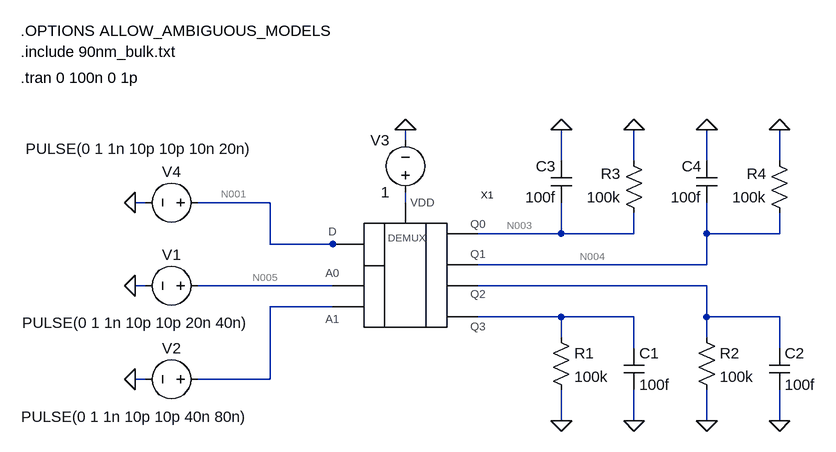
[diagram p0: schematic demux_tests.asc]
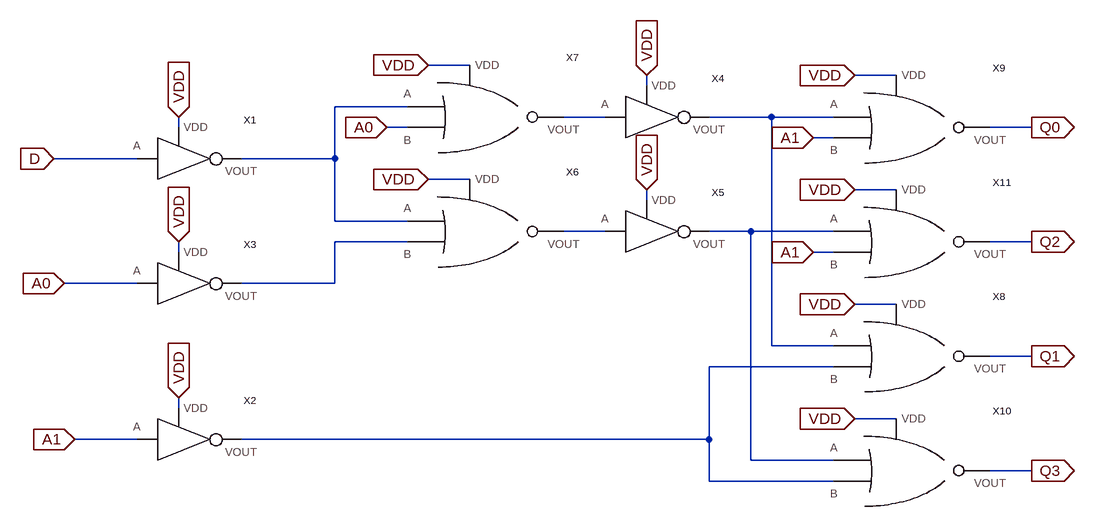
[diagram p1: sub-circuit demux.asc]
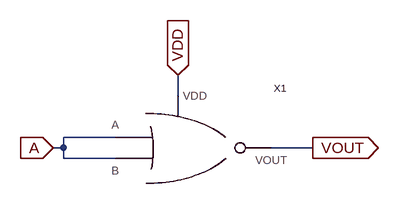
[diagram p2: sub-circuit not.asc]
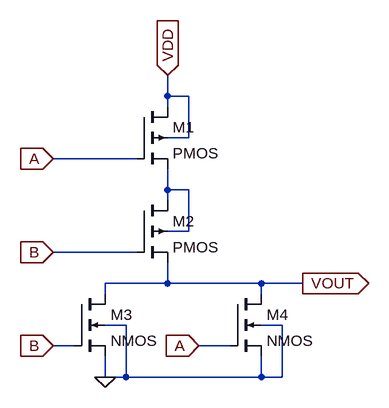
[diagram p3: sub-circuit nor.asc]
demux_tests.asc, the LTspice schematic file:
Version 4.1
SHEET 1 880 680
WIRE 208 64 208 48
WIRE 448 96 448 48
WIRE 560 96 560 48
WIRE 672 96 672 48
WIRE 784 96 784 48
WIRE -192 160 -208 160
WIRE 0 160 -112 160
WIRE 208 160 208 144
WIRE 448 208 448 160
WIRE 448 208 320 208
WIRE 560 208 560 176
WIRE 560 208 448 208
WIRE 672 208 672 160
WIRE 784 208 784 176
WIRE 784 208 672 208
WIRE 0 224 0 160
WIRE 96 224 0 224
WIRE 112 224 96 224
WIRE 672 256 672 208
WIRE 672 256 320 256
WIRE -192 288 -208 288
WIRE 96 288 -112 288
WIRE 672 288 320 288
WIRE 96 320 0 320
WIRE 448 336 320 336
WIRE 560 336 448 336
WIRE 672 336 672 288
WIRE 784 336 672 336
WIRE 448 368 448 336
WIRE 672 368 672 336
WIRE 560 384 560 336
WIRE 784 384 784 336
WIRE -192 432 -208 432
WIRE 0 432 0 320
WIRE 0 432 -112 432
WIRE 448 496 448 448
WIRE 560 496 560 448
WIRE 672 496 672 448
WIRE 784 496 784 448
FLAG 560 496 0
FLAG 448 496 0
FLAG 208 48 0
FLAG -208 288 0
FLAG -208 432 0
FLAG -208 160 0
FLAG 784 496 0
FLAG 672 496 0
FLAG 448 48 0
FLAG 560 48 0
FLAG 672 48 0
FLAG 784 48 0
SYMBOL voltage 208 160 R180
WINDOW 0 24 96 Left 2
WINDOW 3 24 16 Left 2
WINDOW 123 0 0 Left 0
WINDOW 39 0 0 Left 0
SYMATTR InstName V3
SYMATTR Value 1
SYMBOL res 432 352 R0
SYMATTR InstName R1
SYMATTR Value 100k
SYMBOL cap 544 384 R0
SYMATTR InstName C1
SYMATTR Value 100f
SYMBOL voltage -96 288 R90
WINDOW 0 -32 56 VBottom 2
WINDOW 3 41 110 VTop 2
WINDOW 123 0 0 Left 0
WINDOW 39 0 0 Left 0
SYMATTR InstName V1
SYMATTR Value PULSE(0 1 1n 10p 10p 20n 40n)
SYMBOL voltage -96 432 R90
WINDOW 0 -32 56 VBottom 2
WINDOW 3 42 112 VTop 2
WINDOW 123 0 0 Left 0
WINDOW 39 0 0 Left 0
SYMATTR InstName V2
SYMATTR Value PULSE(0 1 1n 10p 10p 40n 80n)
SYMBOL demux 208 272 R0
SYMATTR InstName X1
SYMBOL voltage -96 160 R90
WINDOW 0 -32 56 VBottom 2
WINDOW 3 -98 105 VTop 2
WINDOW 123 0 0 Left 0
WINDOW 39 0 0 Left 0
SYMATTR InstName V4
SYMATTR Value PULSE(0 1 1n 10p 10p 10n 20n)
SYMBOL res 656 352 R0
SYMATTR InstName R2
SYMATTR Value 100k
SYMBOL cap 768 384 R0
SYMATTR InstName C2
SYMATTR Value 100f
SYMBOL res 576 192 R180
WINDOW 0 36 76 Left 2
WINDOW 3 36 40 Left 2
SYMATTR InstName R3
SYMATTR Value 100k
SYMBOL cap 464 160 R180
WINDOW 0 24 56 Left 2
WINDOW 3 24 8 Left 2
SYMATTR InstName C3
SYMATTR Value 100f
SYMBOL res 800 192 R180
WINDOW 0 36 76 Left 2
WINDOW 3 36 40 Left 2
SYMATTR InstName R4
SYMATTR Value 100k
SYMBOL cap 688 160 R180
WINDOW 0 24 56 Left 2
WINDOW 3 24 8 Left 2
SYMATTR InstName C4
SYMATTR Value 100f
TEXT -384 -72 Left 2 !.include 90nm_bulk.txt
TEXT -384 -32 Left 2 !.tran 0 100n 0 1p
TEXT -384 -104 Left 2 !.OPTIONS ALLOW_AMBIGUOUS_MODELS

demux.asc, the sub-circuit schematic file:
Version 4.1
SHEET 1 1972 872
WIRE 656 32 592 32
WIRE 1312 48 1248 48
WIRE 928 64 928 48
WIRE 560 96 448 96
WIRE 864 112 800 112
WIRE 1120 112 1024 112
WIRE 1216 112 1120 112
WIRE 208 128 208 112
WIRE 560 128 528 128
WIRE 1520 128 1456 128
WIRE 1216 144 1184 144
WIRE 144 176 16 176
WIRE 448 176 448 96
WIRE 448 176 304 176
WIRE 656 208 592 208
WIRE 1312 224 1248 224
WIRE 928 240 928 224
WIRE 448 272 448 176
WIRE 560 272 448 272
WIRE 864 288 800 288
WIRE 1088 288 1024 288
WIRE 1216 288 1088 288
WIRE 560 304 448 304
WIRE 1520 304 1456 304
WIRE 208 320 208 304
WIRE 1216 320 1184 320
WIRE 144 368 32 368
WIRE 448 368 448 304
WIRE 448 368 304 368
WIRE 1312 400 1248 400
WIRE 1120 464 1120 112
WIRE 1216 464 1120 464
WIRE 1520 480 1456 480
WIRE 1216 496 1024 496
WIRE 208 560 208 544
WIRE 1312 576 1248 576
WIRE 144 608 48 608
WIRE 1024 608 1024 496
WIRE 1024 608 304 608
WIRE 1088 640 1088 288
WIRE 1216 640 1088 640
WIRE 1520 656 1456 656
WIRE 1024 672 1024 608
WIRE 1216 672 1024 672
FLAG 16 176 D
IOPIN 16 176 In
FLAG 48 608 A1
IOPIN 48 608 In
FLAG 32 368 A0
IOPIN 32 368 In
FLAG 528 128 A0
IOPIN 528 128 In
FLAG 1184 144 A1
IOPIN 1184 144 In
FLAG 1520 128 Q0
IOPIN 1520 128 Out
FLAG 1184 320 A1
IOPIN 1184 320 In
FLAG 1520 304 Q2
IOPIN 1520 304 Out
FLAG 1520 480 Q1
IOPIN 1520 480 Out
FLAG 1520 656 Q3
IOPIN 1520 656 Out
FLAG 1248 48 VDD
IOPIN 1248 48 In
FLAG 1248 224 VDD
IOPIN 1248 224 In
FLAG 1248 400 VDD
IOPIN 1248 400 In
FLAG 1248 576 VDD
IOPIN 1248 576 In
FLAG 592 32 VDD
IOPIN 592 32 In
FLAG 592 208 VDD
IOPIN 592 208 In
FLAG 928 48 VDD
IOPIN 928 48 In
FLAG 928 224 VDD
IOPIN 928 224 In
FLAG 208 112 VDD
IOPIN 208 112 In
FLAG 208 304 VDD
IOPIN 208 304 In
FLAG 208 544 VDD
IOPIN 208 544 In
SYMBOL not 208 176 R0
SYMATTR InstName X1
SYMBOL not 208 608 R0
SYMATTR InstName X2
SYMBOL not 208 368 R0
SYMATTR InstName X3
SYMBOL not 928 112 R0
SYMATTR InstName X4
SYMBOL not 928 288 R0
SYMATTR InstName X5
SYMBOL nor 672 288 R0
SYMATTR InstName X6
SYMBOL nor 672 112 R0
SYMATTR InstName X7
SYMBOL nor 1328 480 R0
SYMATTR InstName X8
SYMBOL nor 1328 128 R0
SYMATTR InstName X9
SYMBOL nor 1328 656 R0
SYMATTR InstName X10
SYMBOL nor 1328 304 R0
SYMATTR InstName X11

not.asc, the sub-circuit schematic file:
Version 4.1
SHEET 1 880 680
WIRE 224 96 224 64
WIRE 128 160 48 160
WIRE 48 176 48 160
WIRE 48 176 32 176
WIRE 432 176 368 176
WIRE 48 192 48 176
WIRE 128 192 48 192
FLAG 224 64 VDD
IOPIN 224 64 In
FLAG 32 176 A
IOPIN 32 176 In
FLAG 432 176 VOUT
IOPIN 432 176 Out
SYMBOL nor 240 176 R0
SYMATTR InstName X1

nor.asc, the sub-circuit schematic file:
Version 4.1
SHEET 1 1028 680
WIRE 272 80 272 48
WIRE 304 80 272 80
WIRE 272 96 272 80
WIRE 304 144 304 80
WIRE 304 144 272 144
WIRE 224 176 96 176
WIRE 272 224 272 192
WIRE 304 224 272 224
WIRE 272 240 272 224
WIRE 304 288 304 224
WIRE 304 288 272 288
WIRE 224 320 96 320
WIRE 272 368 272 336
WIRE 272 368 176 368
WIRE 416 368 272 368
WIRE 480 368 416 368
WIRE 176 384 176 368
WIRE 416 384 416 368
WIRE 208 432 176 432
WIRE 448 432 416 432
WIRE 128 464 96 464
WIRE 368 464 320 464
WIRE 176 512 176 480
WIRE 208 512 208 432
WIRE 208 512 176 512
WIRE 416 512 416 480
WIRE 416 512 208 512
WIRE 448 512 448 432
WIRE 448 512 416 512
FLAG 96 176 A
IOPIN 96 176 In
FLAG 272 48 VDD
IOPIN 272 48 In
FLAG 96 320 B
IOPIN 96 320 In
FLAG 480 368 VOUT
IOPIN 480 368 Out
FLAG 176 512 0
FLAG 320 464 A
IOPIN 320 464 In
FLAG 96 464 B
IOPIN 96 464 In
SYMBOL pmos4 224 96 R0
SYMATTR InstName M1
SYMATTR Value2 l=90n w=400n
SYMBOL pmos4 224 240 R0
SYMATTR InstName M2
SYMATTR Value2 l=90n w=400n
SYMBOL nmos4 368 384 R0
SYMATTR InstName M4
SYMATTR Value2 l=90n w=200n
SYMBOL nmos4 128 384 R0
SYMATTR InstName M3
SYMATTR Value2 l=90n w=200n

The netlist it stands for:
* demux_tests.asc
V3 N002 0 1
R1 N008 0 100k
C1 N008 0 100f
V1 N005 0 PULSE(0 1 1n 10p 10p 20n 40n)
V2 N007 0 PULSE(0 1 1n 10p 10p 40n 80n)
X§X1 N001 N005 N007 N003 N004 N006 N008 N002 demux
V4 N001 0 PULSE(0 1 1n 10p 10p 10n 20n)
R2 N006 0 100k
C2 N006 0 100f
R3 N003 0 100k
C3 N003 0 100f
R4 N004 0 100k
C4 N004 0 100f

* block symbol definitions
.subckt demux D A0 A1 Q0 Q1 Q2 Q3 VDD
X§X1 VDD D N001 not
X§X2 VDD A1 N007 not
X§X3 VDD A0 N006 not
X§X4 VDD N002 N003 not
X§X5 VDD N004 N005 not
X§X6 N001 N006 VDD N004 nor
X§X7 N001 A0 VDD N002 nor
X§X8 N003 N007 VDD Q1 nor
X§X9 N003 A1 VDD Q0 nor
X§X10 N005 N007 VDD Q3 nor
X§X11 N005 A1 VDD Q2 nor
.ends demux

.subckt not VDD A VOUT
X§X1 A A VDD VOUT nor
.ends not

.subckt nor A B VDD VOUT
M1 VDD A N001 VDD PMOS l=90n w=400n
M2 N001 B VOUT N001 PMOS l=90n w=400n
M4 VOUT A 0 0 NMOS l=90n w=200n
M3 VOUT B 0 0 NMOS l=90n w=200n
.ends nor

.model NMOS NMOS
.model PMOS PMOS
.lib standard.mos
.include 90nm_bulk.txt
.tran 0 100n 0 1p
.OPTIONS ALLOW_AMBIGUOUS_MODELS
.backanno
.end

* Results of the author's LTspice run, read from the files saved beside the schematic
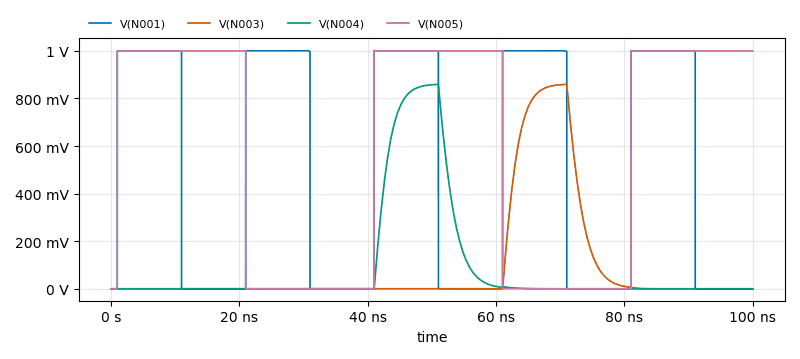
[diagram p4: Transient Analysis of demux_tests.asc, plotted from the saved traces]
* Transient Analysis, 1 run:
*   V(N001): min 0 V, max 1.001 V, average 500.5 mV, rms 707.3 mV, last 0 V
*   V(N003): min 0 V, max 859.4 mV, average 88.89 mV, rms 249.8 mV, last 0 V
*   V(N004): min 0 V, max 859.4 mV, average 89.03 mV, rms 249.8 mV, last 0 V
*   V(N005): min 0 V, max 1.002 V, average 590.1 mV, rms 768.2 mV, last 1 V